# Altium schematic sheet Seven-Seg Displays.SchDoc
size A4; Organization: Machine Intellgence Laboratory; Des1: This board uses a 4-digit; Des2: seven-segment display to show; Des3: battery voltage & current draw.; SheetNumber: 3; SheetTotal: 4; Author1: Russell MacGregor; VersionControl_Repository: BatteryMonitorSpring2025
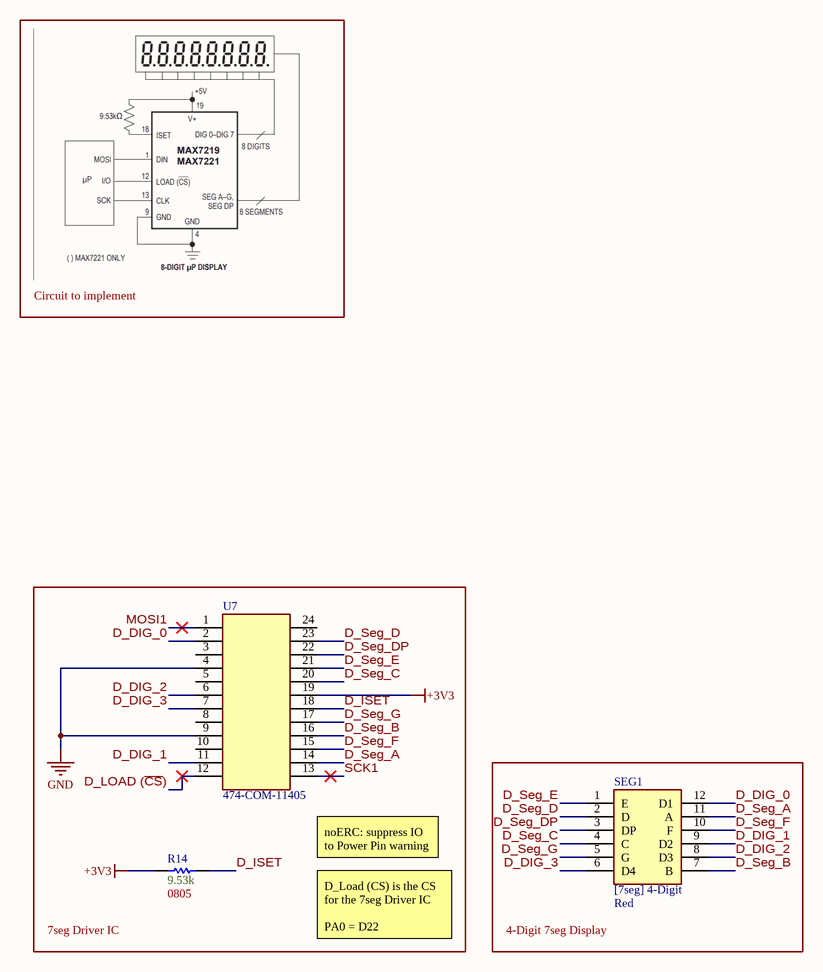
[diagram p0: Seven-Seg Displays.SchDoc]

## Parts
R14  Resistance: 9.53k  Size Package: 0805  [[Res] SMD 0805]  (hidden comment: [Res] SMD Resistor)
SEG1  [7seg] 4-Digit  Color: Red  [[7seg] 4-Digit]
U7  474-COM-11405  [[DIP IC] 24pin, Socket]

## Blocks framed on the sheet
7seg Driver IC: R14 U7
4-Digit 7seg Display: SEG1

## Nets
+3V3: R14.1 U7.19
GND: U7.4 U7.9
D_DIG_0: SEG1.12(D1) U7.2
D_DIG_1: SEG1.9(D2) U7.11
D_DIG_2: SEG1.8(D3) U7.6
D_DIG_3: SEG1.6(D4) U7.7
D_ISET: R14.2 U7.18
D_LOAD (~{CS}): U7.12
D_Seg_A: SEG1.11(A) U7.14
D_Seg_B: SEG1.7(B) U7.16
D_Seg_C: SEG1.4(C) U7.20
D_Seg_D: SEG1.2(D) U7.23
D_Seg_DP: SEG1.3(DP) U7.22
D_Seg_E: SEG1.1(E) U7.21
D_Seg_F: SEG1.10(F) U7.15
D_Seg_G: SEG1.5(G) U7.17
MOSI1: U7.1
SCK1: U7.13

Not connected (* = marked no-connect by the designer): U7 3 5 8 10 24

## Notes on the sheet
- Circuit to implement
- (near U7) noERC: suppress IO to Power Pin warning
- D_Load (CS) is the CS for the 7seg Driver IC
  PA0 = D22
- Project/Vehicle:
- Author(s):
- -
- Revisor(s):
- Git Repo:
- Git Hash:
- Date:
- Revision:
- Size:
- A4
- File:
- Sheet
- of

## Library data of the parts
U7 = [DIP IC] 24pin: Mouser Part #: *
SEG1 = [7seg] 4-Digit: Mouser Part #: 474-COM-11405